# EAGLE schematic arca-2.0-box (EAGLE 9.6.2)
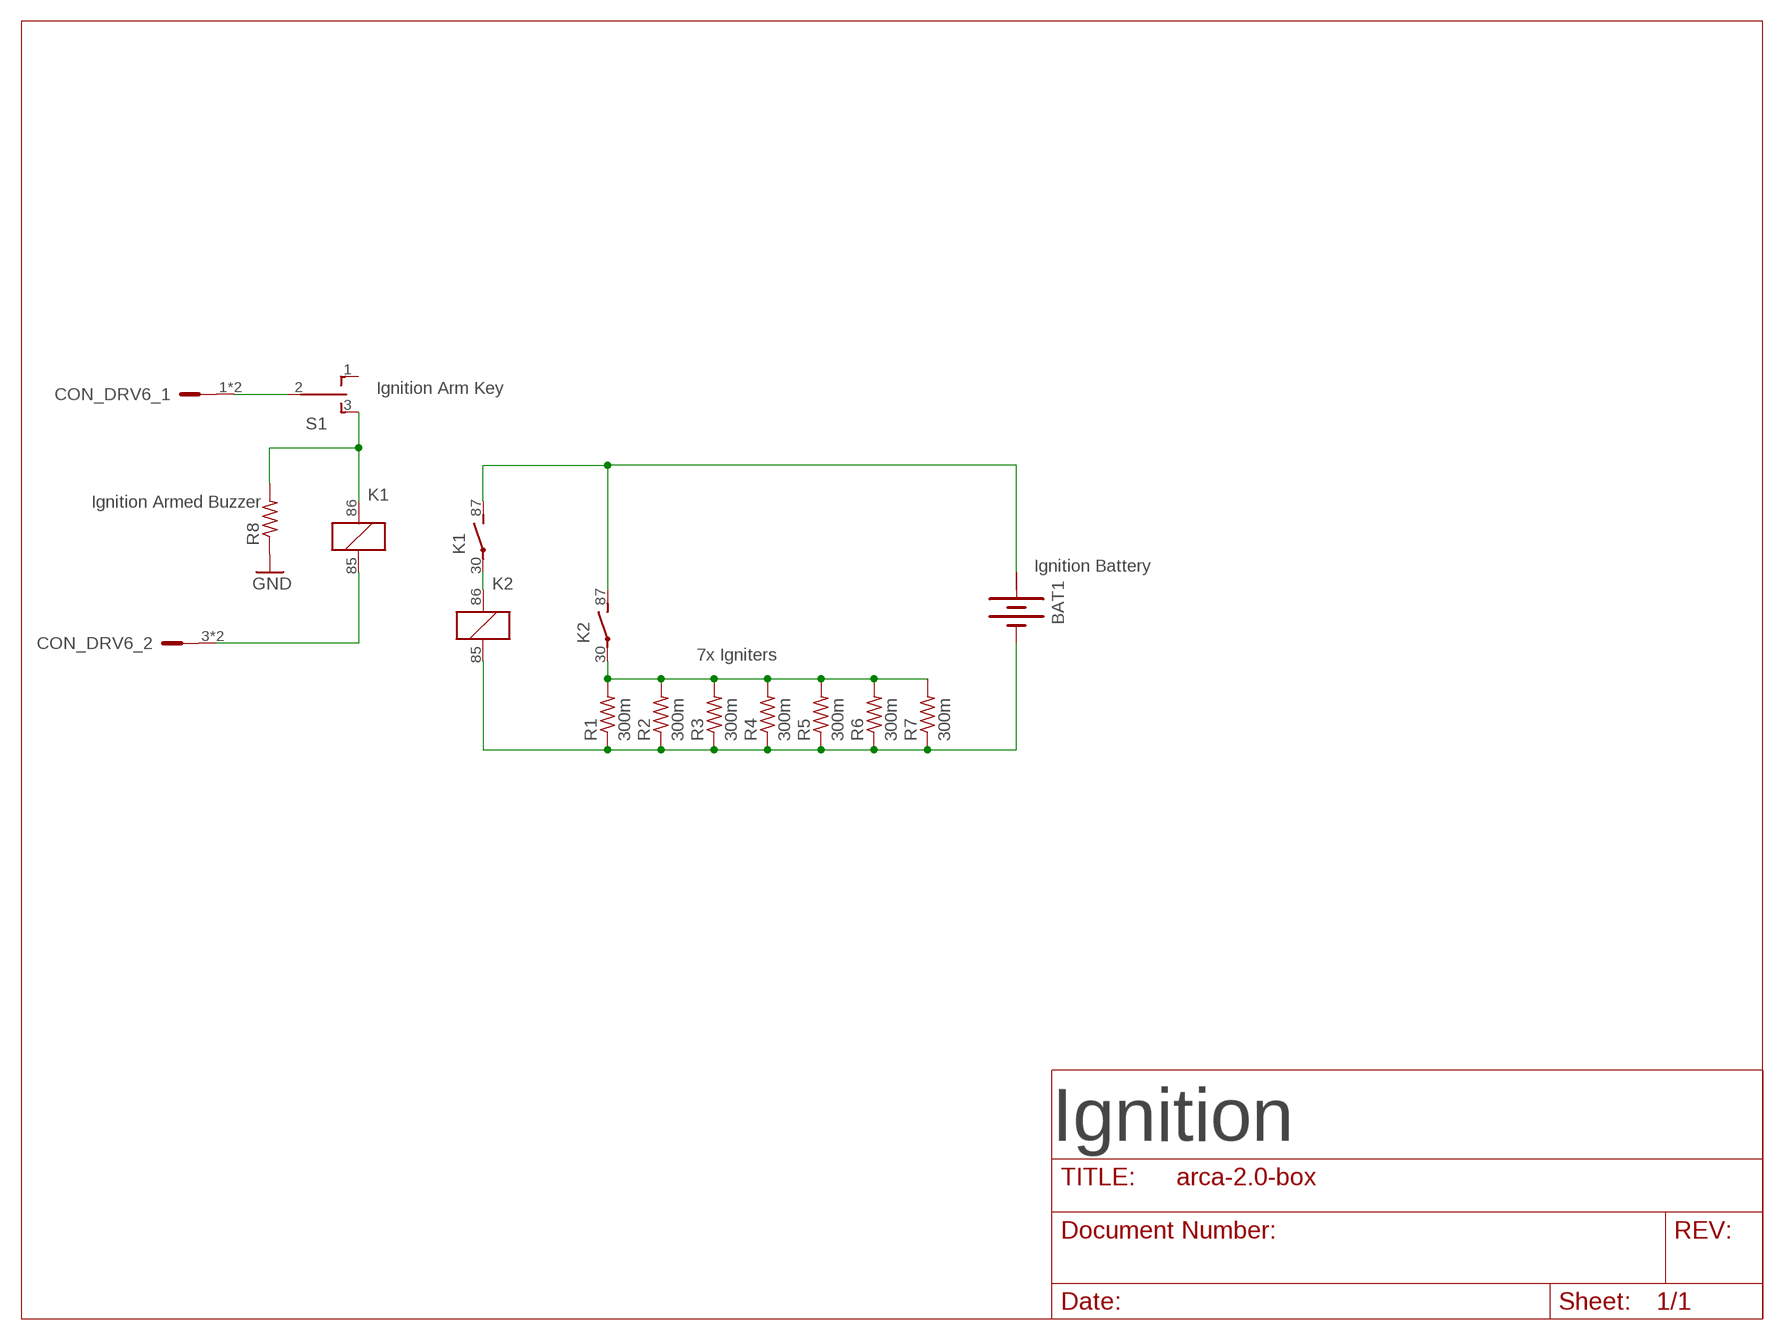
[diagram p0: schematic, sheet 1]

## Parts
BAT1  BATTERY  [BATTERY]
CON_DRV6  LPTA-2POS  [8.2X2]
K1  CB1A-P-12V  [CB1]
K2  CB1A-P-12V  [CB1]
R1  300m  R-US_M0805  [M0805]
R2  300m  R-US_M0805  [M0805]
R3  300m  R-US_M0805  [M0805]
R4  300m  R-US_M0805  [M0805]
R5  300m  R-US_M0805  [M0805]
R6  300m  R-US_M0805  [M0805]
R7  300m  R-US_M0805  [M0805]
R8  Ignition Armed Buzzer  R-US_M0805  [M0805]
S1  TL39PO  [TL3XPO]

## Nets
GND: R8.1
N$1: CON_DRV6.1 CON_DRV6.2 S1.2(P)
N$2: CON_DRV6.3 CON_DRV6.4 K1.85
N$3: K1.30(2:P) K2.86
N$4: K2.30(2:P) R1.2 R2.2 R3.2 R4.2 R5.2 R6.2 R7.2
N$5: BAT1.- K2.85 R1.1 R2.1 R3.1 R4.1 R5.1 R6.1 R7.1
N$6: BAT1.+ K1.87(2:S) K2.87(2:S)
N$7: K1.86 R8.2 S1.3(S)
Unconnected: S1.1(O)

## Notes on the sheet
- Ignition Arm Key
- Ignition Battery
- 7x Igniters
- Ignition

## Power pins joined to a net without a drawn wire
+: BAT1.+@1(+)

## Library data of the parts
BAT1 = special:BATTERY: BATTERY
CON_DRV6 = con-phoenix-5mm:LPTA-2POS
K1 K2 = relay:CB*: HIGH POWER AUTOMOTIVE RELAY Form A NAiS Source: http://www.mew-europe.com/.. en_ds_61202_0000.pdf; MF: AROMAT/ MATSUSHITA; MPN: CB1A-P-12V; OC_FARNELL: 1270582; OC_NEWARK: 50B849
R1-R8 = rcl:R-US_: RESISTOR, American symbol; SPICEPREFIX: R
S1 = switch:TL39PO: TINY SWITCH ON OFF ON Source: http://www2.produktinfo.conrad.com/datenblaetter/700000-724999/705152-da-01-de-Subminiaturschalter_TL_36YO.pdf